# EAGLE design BBBTestCape (EAGLE 8.7.0)
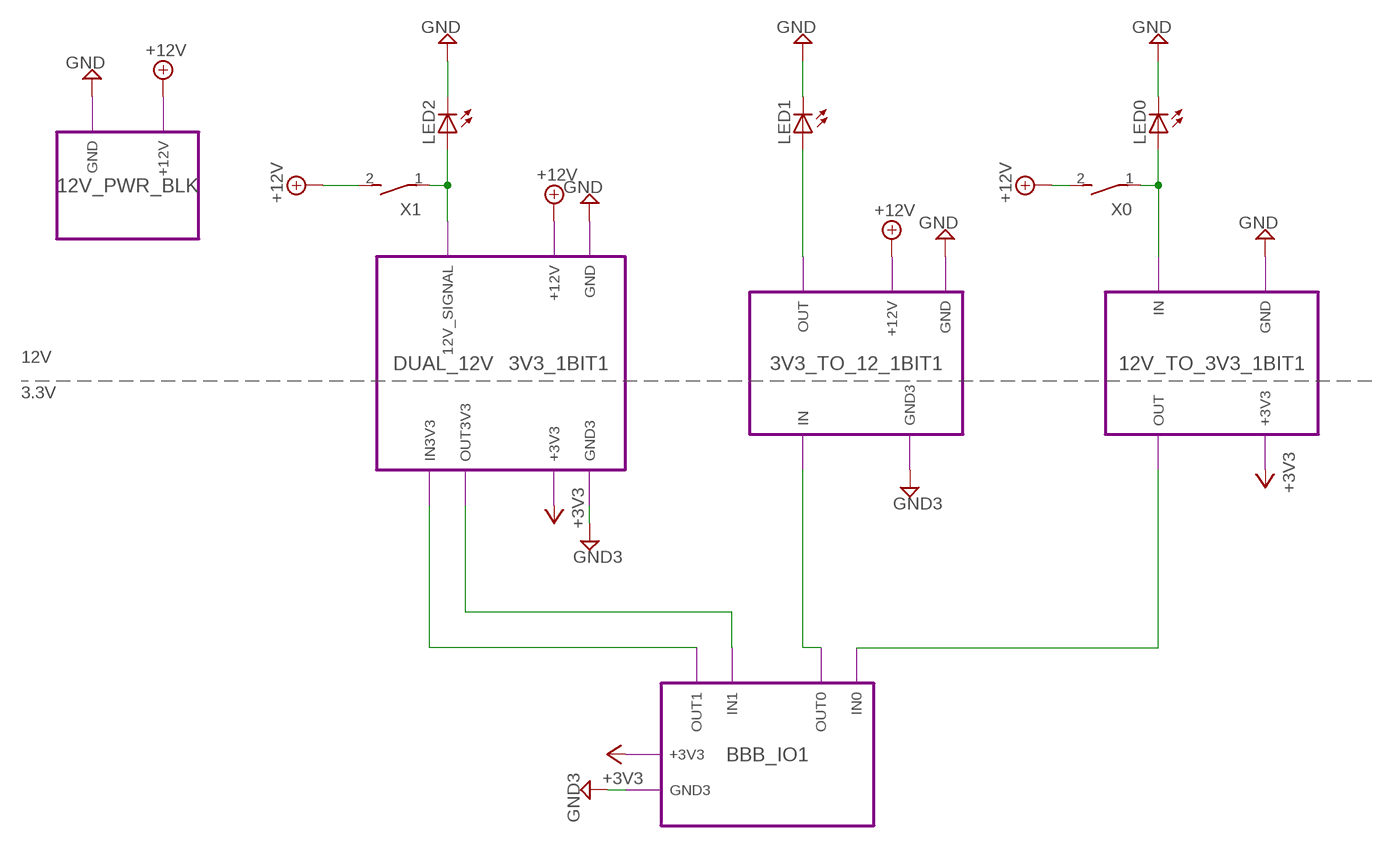
[diagram p0: schematic, sheet 1]

## Parts
LED0  LED3MM  [LED3MM]
LED1  LED3MM  [LED3MM]
LED2  LED3MM  [LED3MM]
X0  SWTCH_BLCK  [1751248]
X1  SWTCH_BLCK  [1751248]

## Module instances
3V3_TO_12_1BIT1 = 3V3_TO_12V_1BIT
12V_PWR_BLK = 12V_PWR_BLK
12V_TO_3V3_1BIT1 = 12V_TO_3V3_1BIT
DUAL_12V⇆3V3_1BIT1 = DUAL_12V⇆3V3_1BIT
BBB_IO1 = BBB_IO

## Nets
+3V3 [pwr]: port 12V_TO_3V3_1BIT1.+3V3 DUAL_12V⇆3V3_1BIT1.+3V3 BBB_IO1.+3V3
+12V [pwr]: X0.2(S) X1.2(S) ; port 12V_PWR_BLK.+12V 3V3_TO_12_1BIT1.+12V DUAL_12V⇆3V3_1BIT1.+12V
GND [pwr]: LED0.K(C) LED1.K(C) LED2.K(C) ; port 12V_PWR_BLK.GND 3V3_TO_12_1BIT1.GND 12V_TO_3V3_1BIT1.GND DUAL_12V⇆3V3_1BIT1.GND
GND3 [pwr]: port 3V3_TO_12_1BIT1.GND3 DUAL_12V⇆3V3_1BIT1.GND3 BBB_IO1.GND3
N$1: LED1.A ; port 3V3_TO_12_1BIT1.OUT
N$2: LED0.A X0.1(P) ; port 12V_TO_3V3_1BIT1.IN
N$3: LED2.A X1.1(P) ; port DUAL_12V⇆3V3_1BIT1.12V_SIGNAL
N$4: port BBB_IO1.OUT1 DUAL_12V⇆3V3_1BIT1.IN3V3
N$5: port BBB_IO1.IN1 DUAL_12V⇆3V3_1BIT1.OUT3V3
N$6: port BBB_IO1.OUT0 3V3_TO_12_1BIT1.IN
N$7: port BBB_IO1.IN0 12V_TO_3V3_1BIT1.OUT

## Notes on the sheet
- 12V
- 3.3V

## Library data of the parts
LED0 LED1 LED2 = relay_computer_custom:LED: VCC 12V LED w/ built-in resistor; OC_NEWARK: unknown
X0 X1 = relay_computer_custom:SWTCH_BLCK: A symbolic switch, that really is backed by a 2 position terminal block; OC_FARNELL: unknown; OC_NEWARK: unknown

## Module 3V3_TO_12V_1BIT
Ports: IN(in) GND3(pwr) OUT(out) +12V(pwr) GND(pwr)
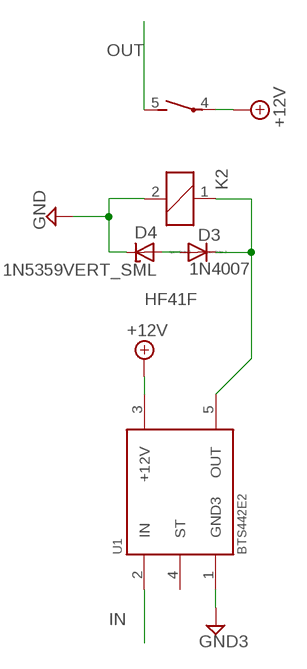
[diagram p1: schematic, module 3V3_TO_12V_1BIT, sheet 1]

### Parts
D3  1N4007  [RAD2,5]
D4  1N5359VERT_SML  [RAD2.5_D2]
K2  HF41F-12-H  [HF41F-12-H]
U1  BTS442E2  [TO170P440X1000X1975-5B]

### Nets
+12V: K2.4(P) U1.3(+12V)
D$2: D3.A D4.A
GND: D4.C K2.2
GND3: U1.1(GND3)
IN: U1.2(IN)
N$1: D3.C K2.1 U1.5(OUT)
OUT: K2.5(S)
Unconnected: U1.4(ST)

### Notes on the sheet
- HF41F

### Library data of the parts
D3 = relay_computer_custom:1N4007: DIODE general purpose rectifier, 1 A; MPN: 1N4007-E3/73; OC_NEWARK: 78K2222
D4 = relay_computer_custom:1N5359: Z DIODE 24 V, 5W; MF: ON SEMICONDUCTOR; MPN: 1N5359BRLG; OC_NEWARK: 42K2893
K2 = relay_computer_custom:HF41F-12-H: SPST RELAY Relay SPST 5mm x 28mm HONGFA; OC_NEWARK: unknown
U1 = relay_computer_custom:BTS442E2: BTS442E2 Smart High Side Power Switch, VBB 63V, R(ON) 18mOhm TO170P440X1000X1975-5B; MPN: BTS442E2BKSA1; OC_NEWARK: 78X4831

## Module 12V_PWR_BLK
Ports: +12V(pwr) GND(pwr)
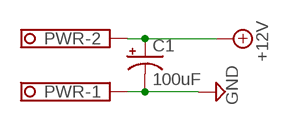
[diagram p2: schematic, module 12V_PWR_BLK, sheet 1]

### Parts
C1  100uF  100UF-POLAR-RADIAL-5MM-50V-20%  [CPOL-RADIAL-5MM-8MM]
PWR  PWR_BLK  [1751248]

### Nets
+12V: C1.1(+) PWR.2
GND: C1.2(-) PWR.1

### Library data of the parts
C1 = relay_computer_custom:100UF-POLAR: 100µF polarized capacitors A capacitor is a passive two-terminal electrical component used to store electrical energy temporarily in an electric field.; PROD_ID: ECA1HM101
PWR = relay_computer_custom:PWR_BLK: MKDS 1/ 2-3,5 Printklemme Nennstrom: 10 A Bemessungsspannung: 160 V Raster: 3,5 mm Polzahl: 2 Montageart: Löten Anschlussart: Schraubanschluss Anschlussrichtung vom Leiter zur Platine: 0° Source: http://eshop.phoenixcontact.com .. 1751248.pdf; OC_FARNELL: unknown; OC_NEWARK: unknown

## Module 3V3_PWR_BLK
Ports: GND3(pwr) +3V3(pwr)
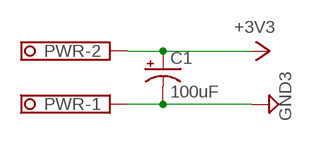
[diagram p3: schematic, module 3V3_PWR_BLK, sheet 1]

### Parts
C1  100uF  100UF-POLAR-RADIAL-5MM-50V-20%  [CPOL-RADIAL-5MM-8MM]
PWR  PWR_BLK  [1751248]

### Nets
+3V3: C1.1(+) PWR.2
GND3: C1.2(-) PWR.1

### Library data of the parts
C1 = relay_computer_custom:100UF-POLAR: 100µF polarized capacitors A capacitor is a passive two-terminal electrical component used to store electrical energy temporarily in an electric field.; PROD_ID: ECA1HM101
PWR = relay_computer_custom:PWR_BLK: MKDS 1/ 2-3,5 Printklemme Nennstrom: 10 A Bemessungsspannung: 160 V Raster: 3,5 mm Polzahl: 2 Montageart: Löten Anschlussart: Schraubanschluss Anschlussrichtung vom Leiter zur Platine: 0° Source: http://eshop.phoenixcontact.com .. 1751248.pdf; OC_FARNELL: unknown; OC_NEWARK: unknown

## Module 12V_TO_3V3_1BIT
Ports: OUT(out) +3V3(pwr) GND(pwr) IN(in)
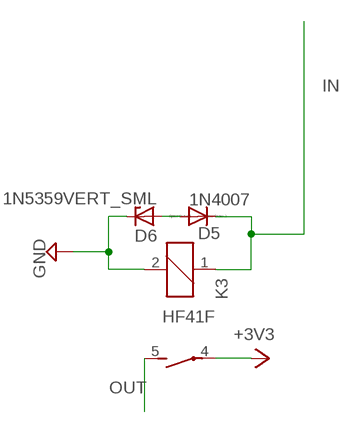
[diagram p4: schematic, module 12V_TO_3V3_1BIT, sheet 1]

### Parts
D5  1N4007  [RAD2,5]
D6  1N5359VERT_SML  [RAD2.5_D2]
K3  HF41F-12-H  [HF41F-12-H]

### Nets
+3V3: K3.4(P)
D$3: D5.A D6.A
GND: D6.C K3.2
IN: D5.C K3.1
OUT: K3.5(S)

### Notes on the sheet
- HF41F

### Library data of the parts
D5 = relay_computer_custom:1N4007: DIODE general purpose rectifier, 1 A; MPN: 1N4007-E3/73; OC_NEWARK: 78K2222
D6 = relay_computer_custom:1N5359: Z DIODE 24 V, 5W; MF: ON SEMICONDUCTOR; MPN: 1N5359BRLG; OC_NEWARK: 42K2893
K3 = relay_computer_custom:HF41F-12-H: SPST RELAY Relay SPST 5mm x 28mm HONGFA; OC_NEWARK: unknown

## Module DUAL_12V⇆3V3_1BIT
Ports: IN3V3(in) OUT3V3(out) +3V3(pwr) GND3(pwr) GND(pwr) +12V(pwr) 12V_SIGNAL(io)
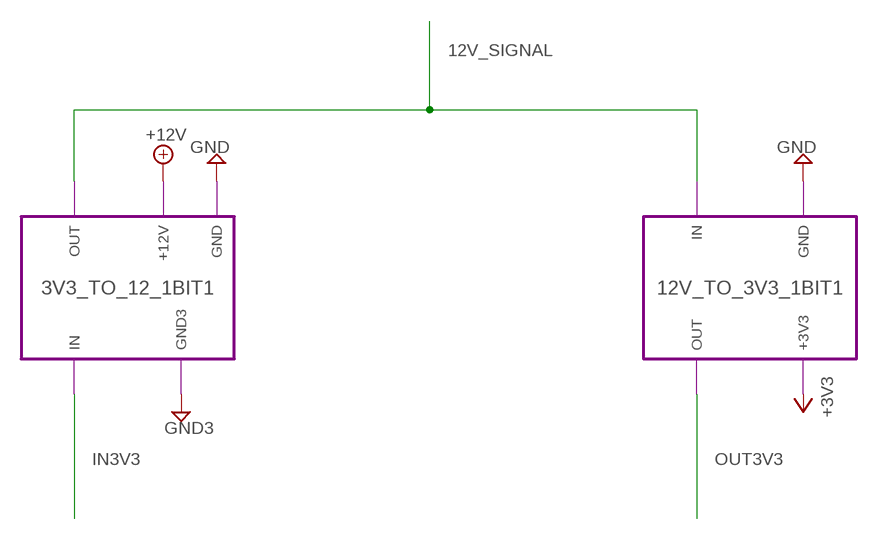
[diagram p5: schematic, module DUAL_12V⇆3V3_1BIT, sheet 1]

### Module instances
3V3_TO_12_1BIT1 = 3V3_TO_12V_1BIT
12V_TO_3V3_1BIT1 = 12V_TO_3V3_1BIT

### Nets
12V_SIGNAL: port 3V3_TO_12_1BIT1.OUT 12V_TO_3V3_1BIT1.IN
+3V3: port 12V_TO_3V3_1BIT1.+3V3
+12V: port 3V3_TO_12_1BIT1.+12V
GND: port 3V3_TO_12_1BIT1.GND 12V_TO_3V3_1BIT1.GND
GND3: port 3V3_TO_12_1BIT1.GND3
IN3V3: port 3V3_TO_12_1BIT1.IN
OUT3V3: port 12V_TO_3V3_1BIT1.OUT

### Library data of the parts

## Module BBB_IO
Ports: OUT0(out) OUT1(out) IN1(in) IN0(in) +3V3(pwr) GND3(pwr)
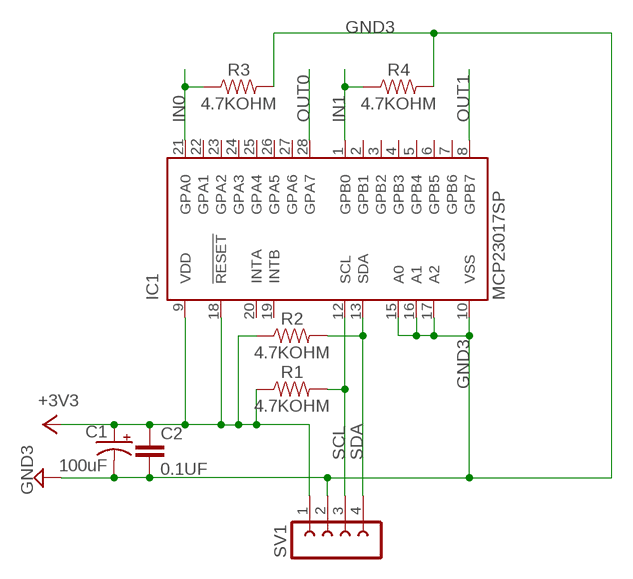
[diagram p6: schematic, module BBB_IO, sheet 1]

### Parts
C1  100uF  100UF-POLAR-RADIAL-5MM-50V-20%  [CPOL-RADIAL-5MM-8MM]
C2  0.1UF  [VERT_CAP]
IC1  MCP23017SP  [DIL28-3]
R1  4.7KOHM  [RAD2.5_RES]
R2  4.7KOHM  [RAD2.5_RES]
R3  4.7KOHM  [RAD2.5_RES]
R4  4.7KOHM  [RAD2.5_RES]
SV1  FE04-1  [FE04-1]

### Nets
+3V3: C1.1(+) C2.A IC1.9(VDD) IC1.18(!RESET) R1.A R2.A SV1.1
GND3: C1.2(-) C2.C IC1.10(VSS) IC1.15(A0) IC1.16(A1) IC1.17(A2) R3.C R4.C SV1.2
IN0: IC1.21(GPA0) R3.A
IN1: IC1.1(GPB0) R4.A
OUT0: IC1.28(GPA7)
OUT1: IC1.8(GPB7)
SCL: IC1.12(SCL) R1.C SV1.3
SDA: IC1.13(SDA) R2.C SV1.4
Unconnected: IC1.2(GPB1) IC1.3(GPB2) IC1.4(GPB3) IC1.5(GPB4) IC1.6(GPB5) IC1.7(GPB6) IC1.19(INTB) IC1.20(INTA) IC1.22(GPA1) IC1.23(GPA2) IC1.24(GPA3) IC1.25(GPA4) IC1.26(GPA5) IC1.27(GPA6)

### Library data of the parts
C1 = relay_computer_custom:100UF-POLAR: 100µF polarized capacitors A capacitor is a passive two-terminal electrical component used to store electrical energy temporarily in an electric field.; PROD_ID: ECA1HM101
C2 = relay_computer_custom:0.1UF: 0.1µF ceramic capacitors A capacitor is a passive two-terminal electrical component used to store electrical energy temporarily in an electric field.
IC1 = relay_computer_custom:MCP23017: http://ww1.microchip.com/downloads/en/DeviceDoc/21952a.pdf Source: http://ww1.microchip.com/downloads/en/DeviceDoc/21952a.pdf
R1-R4 = relay_computer_custom:4.7KOHM: 4.7kΩ resistor A resistor is a passive two-terminal electrical component that implements electrical resistance as a circuit element. Resistors act to reduce current flow, and, at the same time, act to lower voltage levels within circuits. - Wikipedia
SV1 = relay_computer_custom:FE04-1: FEMALE HEADER4 PIN 0.1" Sullins PPPC041LFBN-RC http://www.sullinscorp.com/drawings/78_P(N)PxCxxxLFBN-RC,_10492-H.pdf; MF: Sullins Connector Solutions; MPN: PPPC041LFBN-RC; OC_FARNELL: unknown; OC_NEWARK: unknown

## Net classes
0 default: width 1.016 mm

## Board
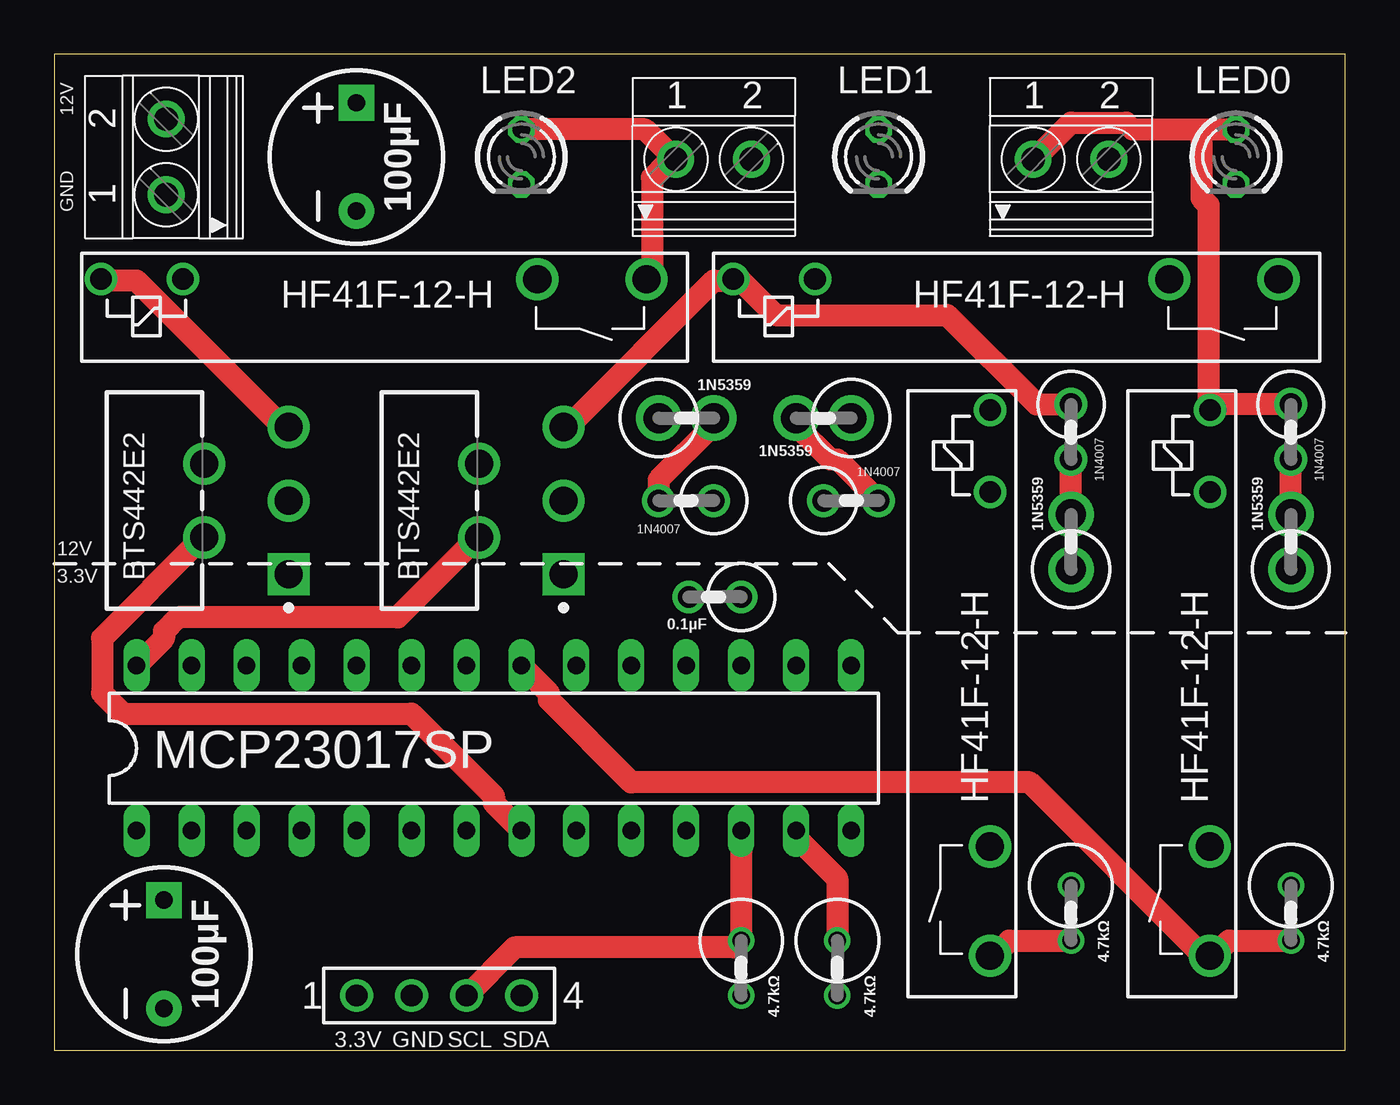
[diagram p7: board, top side]
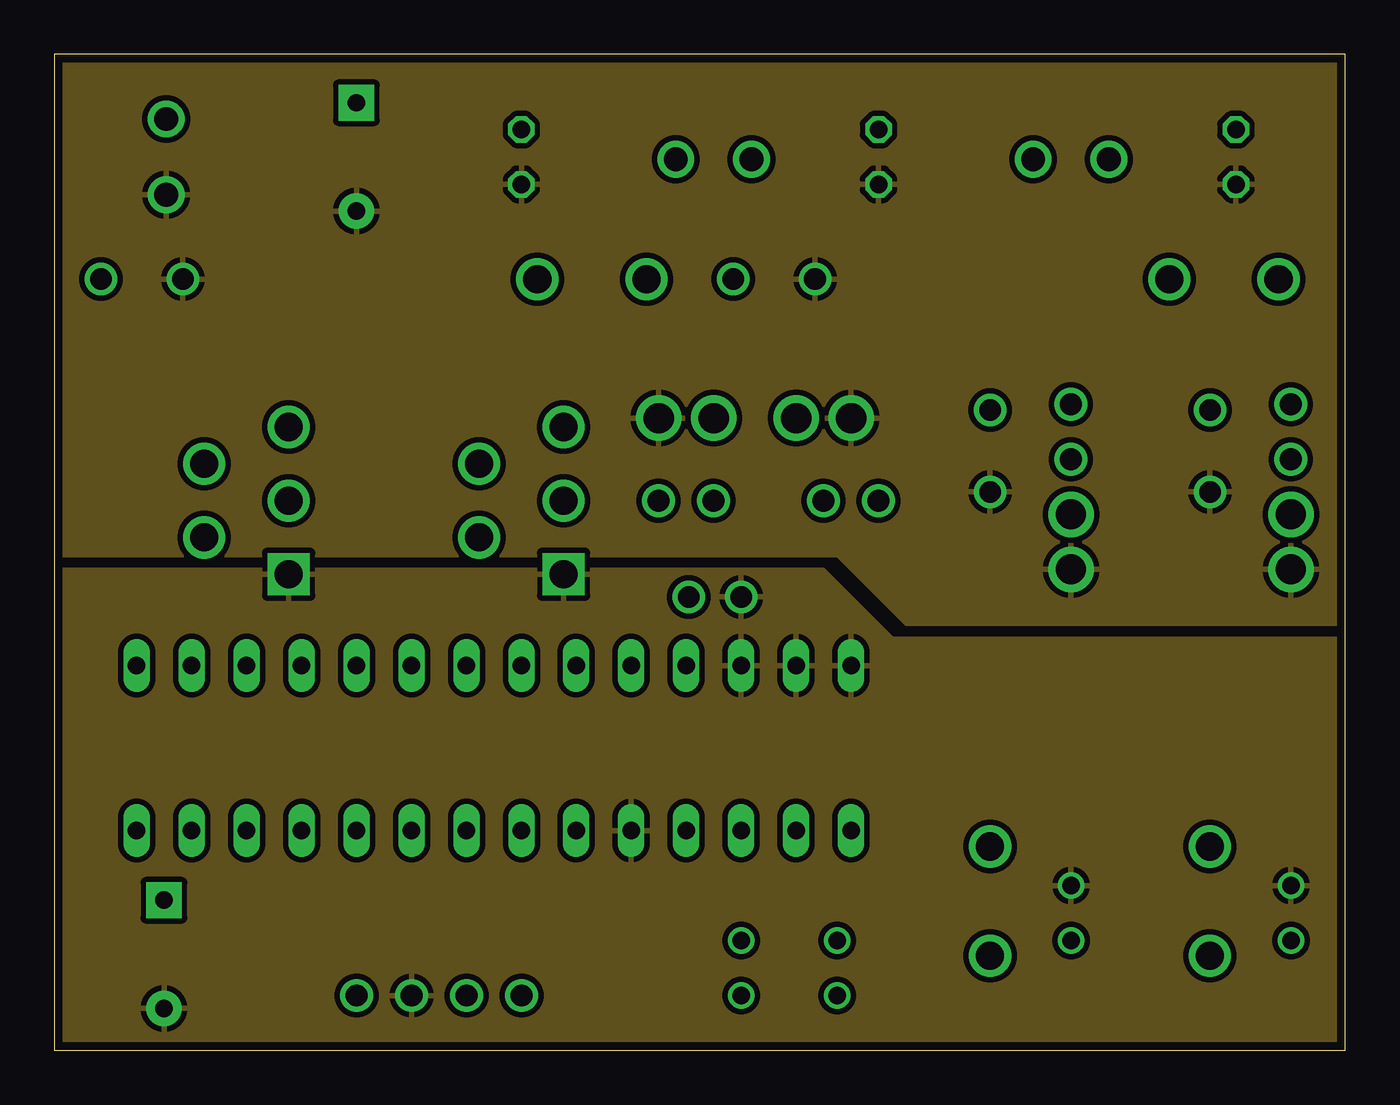
[diagram p8: board, inner layer Route2]
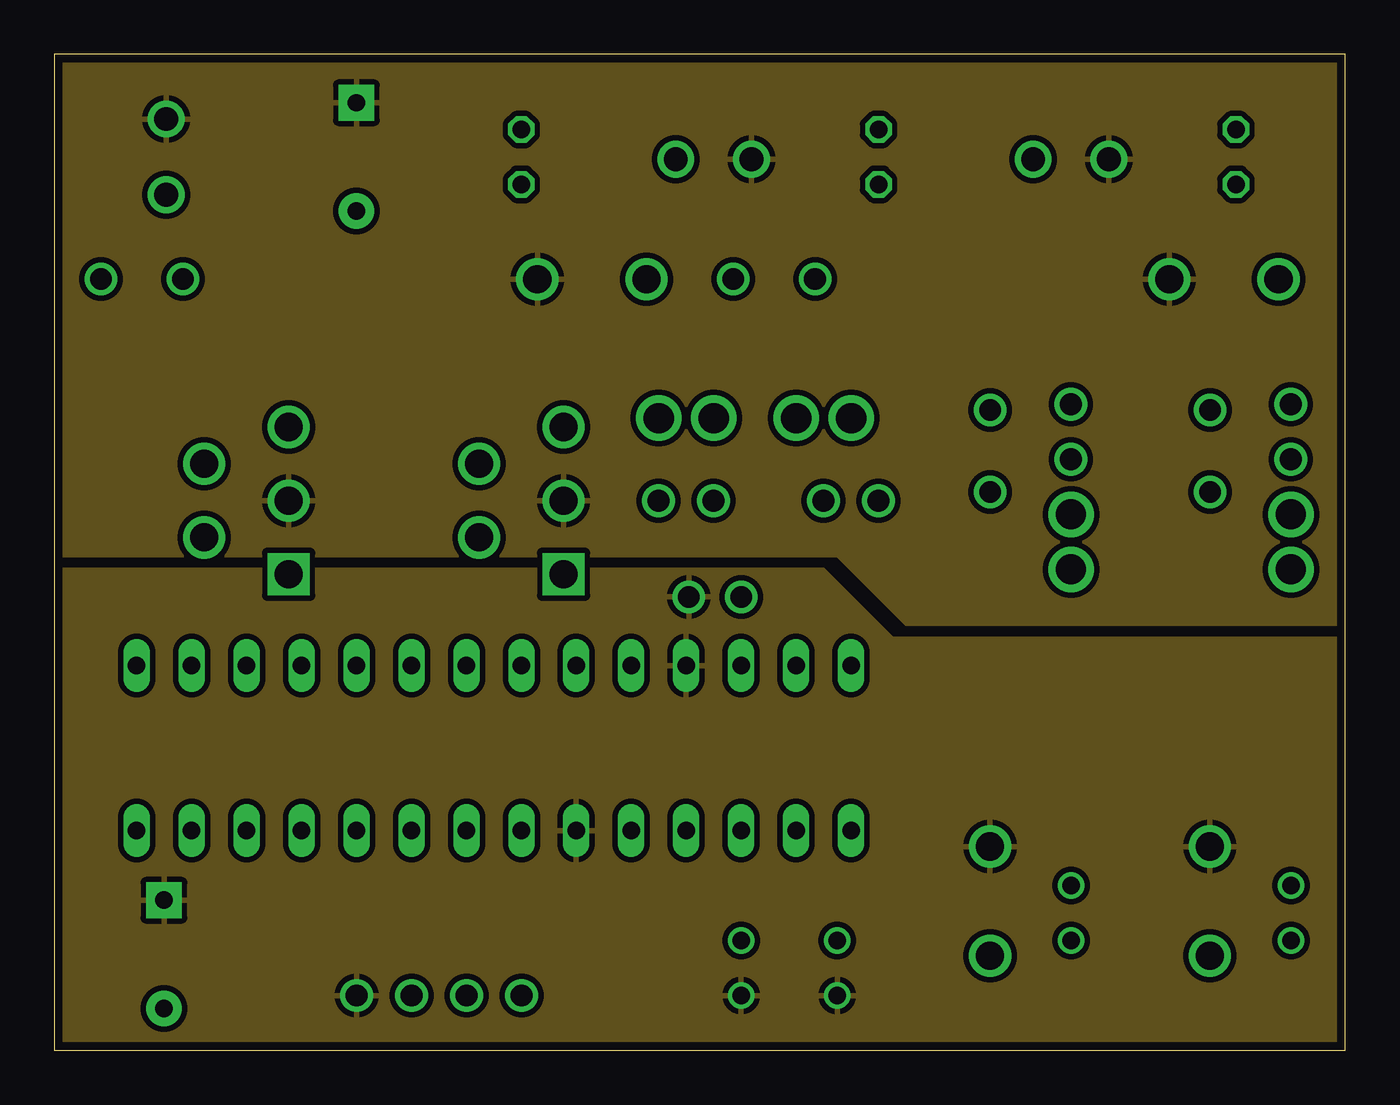
[diagram p9: board, inner layer Route15]
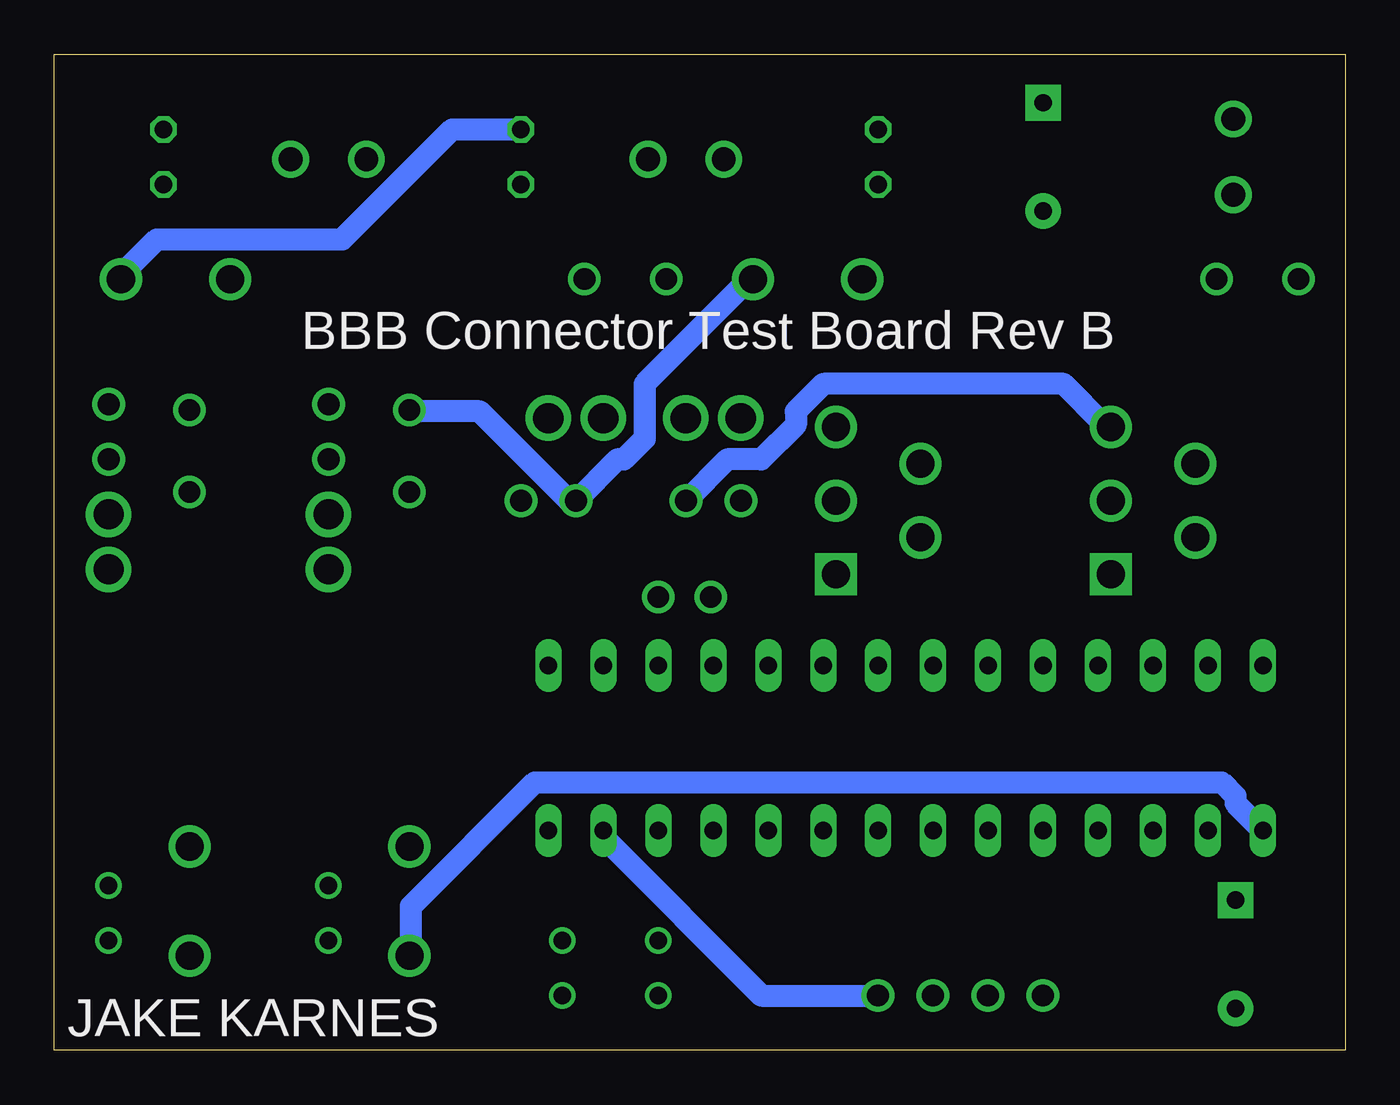
[diagram p10: board, bottom side, seen from below]

Size 59.67 x 46.02 mm. Coordinates in mm from the lower left corner, seen from the top.
Outline: 0,0 59.67,0 59.67,46.02 0,46.02 0,0
Copper layers (1*2*15*16): Top 0.035559375mm / dielectric 0.17018125mm / Route2 0.01778125mm / dielectric 47mil / Route15 0.01778125mm / dielectric 0.17018125mm / Bottom 0.035559375mm
Design rules "oshpark-4layer *": minimum track width 5mil, minimum drill 10mil, track to track 10mil, track to pad 10mil, pad to pad 10mil, via to via 10mil, smd to smd 10mil, copper to edge 15mil, drill to drill 6mil, minimum pad ring 4mil, minimum via ring 4mil, stop-mask expansion 2.5mil, vias tented up to drill 0mil, thermal gap 10mil

### Footprints (pad centres in the part's own frame; a part is rotated, then mirrored left to right if it is on the bottom)
RAD2,5 = drill 1.016: A 1.27,0; C -1.27,0
RAD2.5_D2 = drill 1.397: A 1.27,0; C -1.27,0
HF41F-12-H = drill 1: 1 27.04,1.2; 2 23.26,1.2 | drill 1.3: 4 6.88,1.2; 5 1.84,1.2
TO170P440X1000X1975-5B = drill 1.3 pad 1.9 square: 1 -1.95,3.4 | drill 1.3 pad 1.9: 2 1.95,1.7; 3 -1.95,0; 4 1.95,-1.7; 5 -1.95,-3.4
CPOL-RADIAL-5MM-8MM = drill 0.8 pad 1.651 square: 1 2.5,0 | drill 0.8 pad 1.651: 2 -2.5,0
1751248 = drill 1.1 pad 1.7: 1 -1.75,-0.1; 2 1.75,-0.1
VERT_CAP = drill 1: A 1.15,0; C -1.27,0
DIL28-3 = drill 0.813 long: 1 -16.51,-3.81; 2 -13.97,-3.81; 3 -11.43,-3.81; 4 -8.89,-3.81; 5 -6.35,-3.81; 6 -3.81,-3.81; 7 -1.27,-3.81; 8 1.27,-3.81; 9 3.81,-3.81; 10 6.35,-3.81; 11 8.89,-3.81; 12 11.43,-3.81; 13 13.97,-3.81; 14 16.51,-3.81; 15 16.51,3.81; 16 13.97,3.81; 17 11.43,3.81; 18 8.89,3.81; 19 6.35,3.81; 20 3.81,3.81; 21 1.27,3.81; 22 -1.27,3.81; 23 -3.81,3.81; 24 -6.35,3.81; 25 -8.89,3.81; 26 -11.43,3.81; 27 -13.97,3.81; 28 -16.51,3.81
RAD2.5_RES = drill 0.813: A 1.27,0; C -1.27,0
FE04-1 = drill 1.016: 1 -3.81,0; 2 -1.27,0; 3 1.27,0; 4 3.81,0
LED3MM = drill 0.813 octagon: A -1.27,0; K 1.27,0

### Placement (x,y rotation side)
3V3_TO_12_1BIT1:D3  1N4007  [RAD2,5]  46.99,28.57 270 top
3V3_TO_12_1BIT1:D4  1N5359VERT_SML  [RAD2.5_D2]  46.99,23.5 90 top
3V3_TO_12_1BIT1:K2  HF41F-12-H  [HF41F-12-H]  58.42,36.83 180 top
3V3_TO_12_1BIT1:U1  BTS442E2  [TO170P440X1000X1975-5B]  21.59,25.4 180 top
12V_PWR_BLK:C1  100uF  [CPOL-RADIAL-5MM-8MM]  13.97,41.27 90 top
12V_PWR_BLK:PWR  PWR_BLK  [1751248]  5.08,41.27 90 top
12V_TO_3V3_1BIT1:D5  1N4007  [RAD2,5]  57.15,28.57 270 top
12V_TO_3V3_1BIT1:D6  1N5359VERT_SML  [RAD2.5_D2]  57.15,23.5 90 top
12V_TO_3V3_1BIT1:K3  HF41F-12-H  [HF41F-12-H]  54.61,2.54 90 top
BBB_IO1:C1  100uF  [CPOL-RADIAL-5MM-8MM]  5.08,4.45 90 top
BBB_IO1:C2  0.1UF  [VERT_CAP]  30.48,20.95 180 top
BBB_IO1:IC1  MCP23017SP  [DIL28-3]  20.32,13.97 0 top
BBB_IO1:R1  4.7KOHM  [RAD2.5_RES]  31.75,3.81 270 top
BBB_IO1:R2  4.7KOHM  [RAD2.5_RES]  36.2,3.81 270 top
BBB_IO1:R3  4.7KOHM  [RAD2.5_RES]  57.15,6.35 270 top
BBB_IO1:R4  4.7KOHM  [RAD2.5_RES]  46.99,6.35 270 top
BBB_IO1:SV1  [FE04-1]  17.78,2.54 0 top
DUAL_12V⇆3V3_1BIT1:3V3_TO_12_1BIT1:D3  1N4007  [RAD2,5]  29.21,25.4 180 top
DUAL_12V⇆3V3_1BIT1:3V3_TO_12_1BIT1:D4  1N5359VERT_SML  [RAD2.5_D2]  29.21,29.21 0 top
DUAL_12V⇆3V3_1BIT1:3V3_TO_12_1BIT1:K2  HF41F-12-H  [HF41F-12-H]  29.21,36.83 180 top
DUAL_12V⇆3V3_1BIT1:3V3_TO_12_1BIT1:U1  BTS442E2  [TO170P440X1000X1975-5B]  8.89,25.4 180 top
DUAL_12V⇆3V3_1BIT1:12V_TO_3V3_1BIT1:D5  1N4007  [RAD2,5]  36.83,25.4 0 top
DUAL_12V⇆3V3_1BIT1:12V_TO_3V3_1BIT1:D6  1N5359VERT_SML  [RAD2.5_D2]  35.56,29.21 180 top
DUAL_12V⇆3V3_1BIT1:12V_TO_3V3_1BIT1:K3  HF41F-12-H  [HF41F-12-H]  44.45,2.54 90 top
LED0  54.61,41.27 270 top
LED1  38.1,41.27 270 top
LED2  21.59,41.27 270 top
X0  46.99,41.27 0 top
X1  30.48,41.27 0 top

### Tracks (layer width: path | path; a pad name or v marks a point on that pad's centre or on a via)
3V3_TO_12_1BIT1:D$2
  Top 1.016: 3V3_TO_12_1BIT1:D4.A 3V3_TO_12_1BIT1:D3.A
3V3_TO_12_1BIT1:N$1
  Top 1.016: 3V3_TO_12_1BIT1:U1.5 23.81,28.89 30.48,35.56 31.11,35.56 3V3_TO_12_1BIT1:K2.1 31.75,35.56 33.34,33.97 41.27,33.97 45.4,29.84 3V3_TO_12_1BIT1:D3.C
12V_TO_3V3_1BIT1:D$3
  Top 1.016: 12V_TO_3V3_1BIT1:D6.A 12V_TO_3V3_1BIT1:D5.A
+3V3
  pour Route15 (isolate 0.254): 0,22.23 35.56,22.23 38.73,19.05 59.69,19.05 59.69,0 0,0
+12V
  pour Route15 (isolate 0.254): 59.69,19.68 59.69,46.35 0,46.35 0,22.86 36.2,22.86 39.37,19.68
BBB_IO1:SCL
  Top 1.016: BBB_IO1:IC1.12 BBB_IO1:R1.C 31.43,4.76 21.27,4.76 BBB_IO1:SV1.3
BBB_IO1:SDA
  Top 1.016: BBB_IO1:R2.C 36.2,7.94 34.29,9.84 BBB_IO1:IC1.13
  Bottom 1.016: BBB_IO1:SV1.4 26.99,2.54 34.29,9.84 BBB_IO1:IC1.13
DUAL_12V⇆3V3_1BIT1:3V3_TO_12_1BIT1:D$2
  Top 1.016: DUAL_12V⇆3V3_1BIT1:3V3_TO_12_1BIT1:D3.A 27.94,26.35 30.48,28.89 DUAL_12V⇆3V3_1BIT1:3V3_TO_12_1BIT1:D4.A
DUAL_12V⇆3V3_1BIT1:3V3_TO_12_1BIT1:N$1
  Top 1.016: DUAL_12V⇆3V3_1BIT1:3V3_TO_12_1BIT1:K2.1 2.22,35.56 3.81,35.56 10.79,28.57 DUAL_12V⇆3V3_1BIT1:3V3_TO_12_1BIT1:U1.5
  Bottom 1.016: DUAL_12V⇆3V3_1BIT1:3V3_TO_12_1BIT1:D3.C 28.57,27.3 26.99,27.3 25.4,28.89 25.4,29.53 24.13,30.8 13.02,30.8 11.11,28.89 DUAL_12V⇆3V3_1BIT1:3V3_TO_12_1BIT1:U1.5
DUAL_12V⇆3V3_1BIT1:12V_TO_3V3_1BIT1:D$3
  Top 1.016: DUAL_12V⇆3V3_1BIT1:12V_TO_3V3_1BIT1:D5.A 36.2,27.3 35.88,27.3 34.29,28.89 DUAL_12V⇆3V3_1BIT1:12V_TO_3V3_1BIT1:D6.A
GND
  pour Route2 (isolate 0.254): 0,46.35 59.69,46.35 59.69,19.68 39.37,19.68 36.2,22.86 0,22.86
GND3
  pour Route2 (isolate 0.254): 0,22.23 35.56,22.23 38.73,19.05 59.69,19.05 59.69,0 0,0
N$1
  Bottom 1.016: LED1.A 41.27,42.55 46.35,37.47 54.93,37.47 56.52,35.88 3V3_TO_12_1BIT1:K2.5
N$2
  Top 1.016: 12V_TO_3V3_1BIT1:D5.C 53.66,29.84 12V_TO_3V3_1BIT1:K3.1 53.34,30.16 53.34,39.05 53.02,39.37 53.02,42.55 | 53.02,42.55 49.85,42.55 49.53,42.86 46.99,42.86 45.4,41.27 X0.1 | 53.02,42.55 LED0.A
N$3
  Top 1.016: LED2.A 27.3,42.55 28.57,41.27 X1.1 28.26,40.96 27.62,40.32 27.62,35.88 DUAL_12V⇆3V3_1BIT1:3V3_TO_12_1BIT1:K2.5
  Bottom 1.016: DUAL_12V⇆3V3_1BIT1:12V_TO_3V3_1BIT1:K3.1 43.18,29.53 40.01,29.53 35.88,25.4 DUAL_12V⇆3V3_1BIT1:12V_TO_3V3_1BIT1:D5.C 33.66,27.3 33.34,27.3 32.38,28.26 32.38,30.8 27.62,35.56 DUAL_12V⇆3V3_1BIT1:3V3_TO_12_1BIT1:K2.5
N$4
  Top 1.016: BBB_IO1:IC1.8 20.32,11.43 20.32,11.75 16.51,15.56 3.17,15.56 2.22,16.51 2.22,19.05 6.67,23.5 DUAL_12V⇆3V3_1BIT1:3V3_TO_12_1BIT1:U1.2
N$5
  Top 1.016: BBB_IO1:R4.A 44.13,5.08 43.5,4.45 DUAL_12V⇆3V3_1BIT1:12V_TO_3V3_1BIT1:K3.5
  Bottom 1.016: BBB_IO1:IC1.1 5.08,11.43 5.08,11.75 5.71,12.38 37.47,12.38 43.18,6.67 43.18,4.45 DUAL_12V⇆3V3_1BIT1:12V_TO_3V3_1BIT1:K3.5
N$6
  Top 1.016: BBB_IO1:IC1.28 5.08,19.05 5.08,19.37 5.71,20 15.88,20 19.37,23.5 3V3_TO_12_1BIT1:U1.2
N$7
  Top 1.016: BBB_IO1:R3.A 54.29,5.08 53.66,4.45 12V_TO_3V3_1BIT1:K3.5 53.02,4.45 45.09,12.38 26.67,12.38 22.86,16.19 22.86,16.51 BBB_IO1:IC1.21

### Text on the board
tNames: 12V | GND | 12V | 3.3V | 3.3V | GND | SCL | SDA
bNames: BBB Connector Test Board Rev B | JAKE KARNES